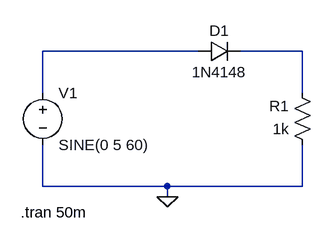
[diagram p0: schematic Half_Wave_1N4148.asc]
Half_Wave_1N4148.asc, the LTspice schematic file:
Version 4
SHEET 1 880 680
WIRE 176 96 -64 96
WIRE 336 96 240 96
WIRE -64 160 -64 96
WIRE 336 160 336 96
WIRE -64 304 -64 240
WIRE 128 304 -64 304
WIRE 336 304 336 240
WIRE 336 304 128 304
WIRE 128 320 128 304
FLAG 128 320 0
SYMBOL diode 176 112 R270
WINDOW 0 32 32 VTop 2
WINDOW 3 0 32 VBottom 2
SYMATTR InstName D1
SYMATTR Value 1N4148
SYMBOL voltage -64 144 R0
WINDOW 123 0 0 Left 0
WINDOW 39 0 0 Left 0
SYMATTR InstName V1
SYMATTR Value SINE(0 5 60)
SYMBOL res 352 256 R180
WINDOW 0 36 76 Left 2
WINDOW 3 36 40 Left 2
SYMATTR InstName R1
SYMATTR Value 1k
TEXT -98 344 Left 2 !.tran 50m

The netlist it stands for:
* Half_Wave_1N4148.asc
D1 N001 N002 1N4148
V1 N001 0 SINE(0 5 60)
R1 0 N002 1k
.model D D
.lib standard.dio
.tran 50m
.backanno
.end